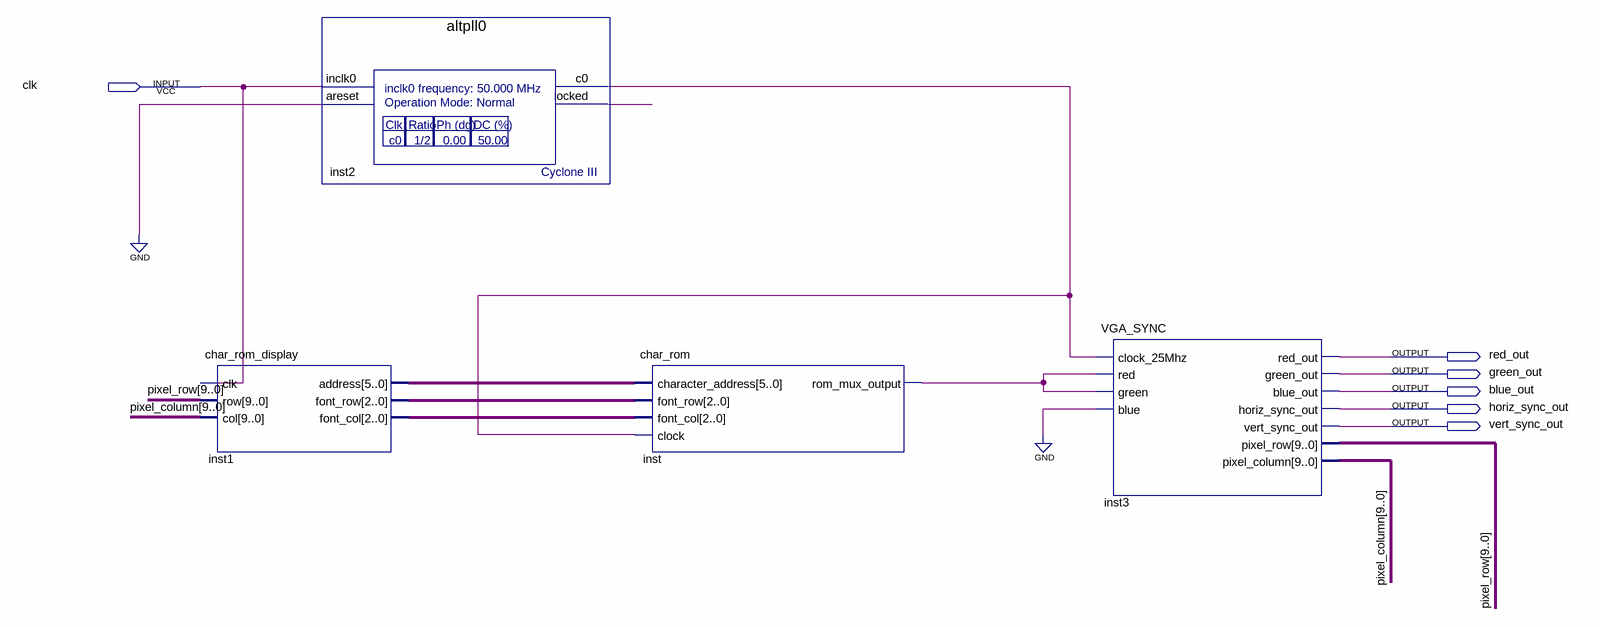
[diagram p0: schematic sheet]
// Quartus schematic Char_RomExample.bdf as structural Verilog: 4 symbols, 6 pins
module Char_RomExample (
  input  clk,
  output red_out,
  output green_out,
  output blue_out,
  output horiz_sync_out,
  output vert_sync_out
);

  wire inst2_c0, inst2_locked, inst_rom_mux_output;
  wire [2:0] inst1_font_col, inst1_font_row;
  wire [5:0] inst1_address;
  wire [9:0] pixel_column, pixel_row;

  char_rom_display inst1 (
    .clk(clk), .row(pixel_row), .col(pixel_column), .address(inst1_address), .font_row(inst1_font_row),
    .font_col(inst1_font_col));
  altpll0 inst2 (.inclk0(clk), .areset(1'b0), .c0(inst2_c0), .locked(inst2_locked));
  char_rom inst (
    .character_address(inst1_address), .font_row(inst1_font_row), .font_col(inst1_font_col),
    .clock(inst2_c0), .rom_mux_output(inst_rom_mux_output));
  VGA_SYNC inst3 (
    .clock_25Mhz(inst2_c0), .red(inst_rom_mux_output), .green(inst_rom_mux_output), .blue(1'b0),
    .red_out(red_out), .green_out(green_out), .blue_out(blue_out), .horiz_sync_out(horiz_sync_out),
    .vert_sync_out(vert_sync_out), .pixel_row(pixel_row), .pixel_column(pixel_column));
endmodule
